# Altium project LCD_Module.PrjPcb
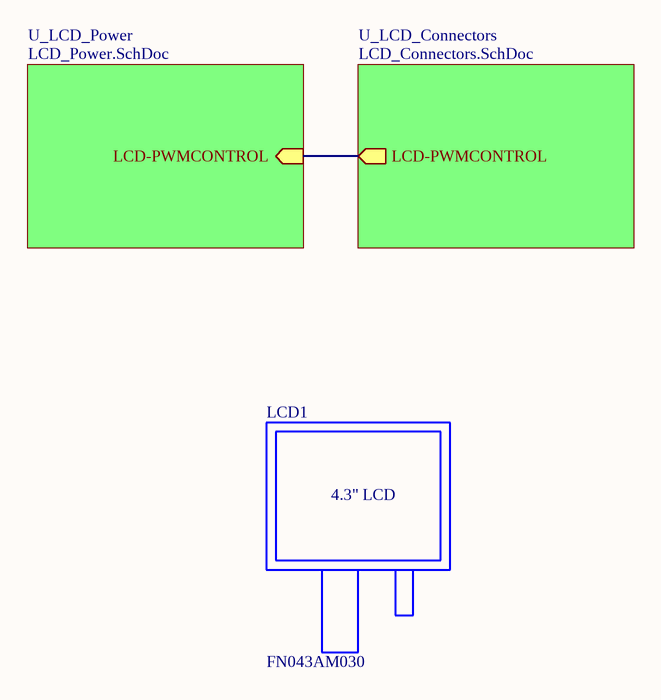
[diagram p0: Main.SchDoc]
3 sheets, 14 parts. Net scope: hierarchical (ports join the sheet entries above them; power ports are global).
Board file: LDC_Module.PcbDoc
Sheets:
  Main.SchDoc
    U_LCD_Power = LCD_Power.SchDoc
    U_LCD_Connectors = LCD_Connectors.SchDoc

## Sheet Main.SchDoc
size A4; SheetNumber: 1; SheetTotal: 3

### Parts
LCD1  FN043AM030  [LCD_4.3"]

### Sub-sheets
U_LCD_Connectors = LCD_Connectors.SchDoc: LCD-PWMCONTROL (out)
U_LCD_Power = LCD_Power.SchDoc: LCD-PWMCONTROL (in)

### Nets
LCD-PWMCONTROL: sheet U_LCD_Power/LCD-PWMCONTROL, sheet U_LCD_Connectors/LCD-PWMCONTROL

### Notes on the sheet
- (in symbol FN043AM030) 4.3" LCD

### Library data of the parts
LCD1 = FN043AM030: TFT 4.3” 480X272 WITH CTP FT5426; Manufacturer: FANNAL; MFC PN: FN043AM030; Value: FN043AM030; Assembly: *; Help URL: https://www.ozdisan.com/p/tft-paneller-381/fannal-fn043am030-v1-0-535823

## Sheet LCD_Power.SchDoc
size A4; SheetNumber: 2; SheetTotal: 3
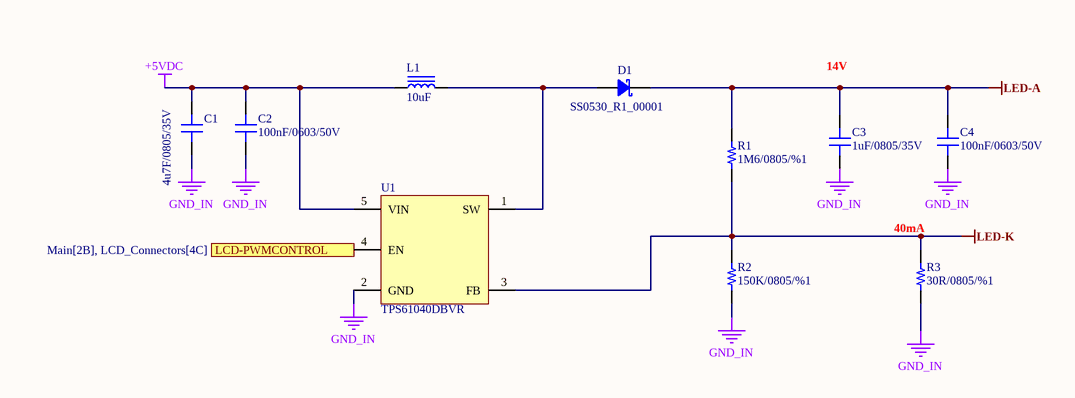
[diagram p1: LCD_Power.SchDoc]

### Parts
C1  4u7F/0805/35V  [0805_cap]
C2  100nF/0603/50V  [0603_cap]
C3  1uF/0805/35V  [0603_cap]
C4  100nF/0603/50V  [0603_cap]
D1  SS0530_R1_00001  [SOD-123]
L1  10uF  [IND(4.5mmX4mm)]
R1  1M6/0805/%1  [0805_res]
R2  150K/0805/%1  [0805_res]
R3  30R/0805/%1  [0805_res]
U1  TPS61040DBVR  [SOT-23-5]

### Ports
LCD-PWMCONTROL (in, see Main[2B], LCD_Connectors[4C])

### Nets
+5VDC: C1.2 C2.2 L1.1 U1.5(VIN)
GND_IN: C1.1 C2.1 C3.1 C4.1 R2.1 R3.1 U1.2(GND)
LED-A: C3.2 C4.2 D1.1 R1.2
LED-K: R1.1 R2.2 R3.2 U1.3(FB)
LCD-PWMCONTROL: U1.4(EN) ; port LCD-PWMCONTROL
NetD1_2: D1.2 L1.2 U1.1(SW)

### Notes on the sheet
- 14V
- (near R3) 40mA

### Library data of the parts
C1-C4 = Capacitor: HelpURL: *; PN: *; Assembly: *
  C1: Value: 4u7F/0805/35V
  C2 C4: Value: 100nF/0603/50V
  C3: Value: 1uF/0805/35V
D1 = SCHOTKY DIODE
L1 = Inductor: CR32NP-100KC
R1-R3 = RES: Assembly: .; HelpURL: *; PN: *
  R1: Value: 1M6/0805/%1
  R2: Value: 150K/0805/%1
  R3: Value: 30R/0805/%1
U1 = TPS61040DBVR: LED Driver IC 1 Output DC DC Regulator Step-Up (Boost) PWM Dimming 350mA (Switch) SOT-23-5; Manufacturer: Texas Instruments; Assembly: .; HelpURL: https://www.digikey.com/en/products/detail/texas-instruments/TPS61040DBVR/454263; Value: TPS61040DBVR

## Sheet LCD_Connectors.SchDoc
size A4; SheetNumber: 3; SheetTotal: 3
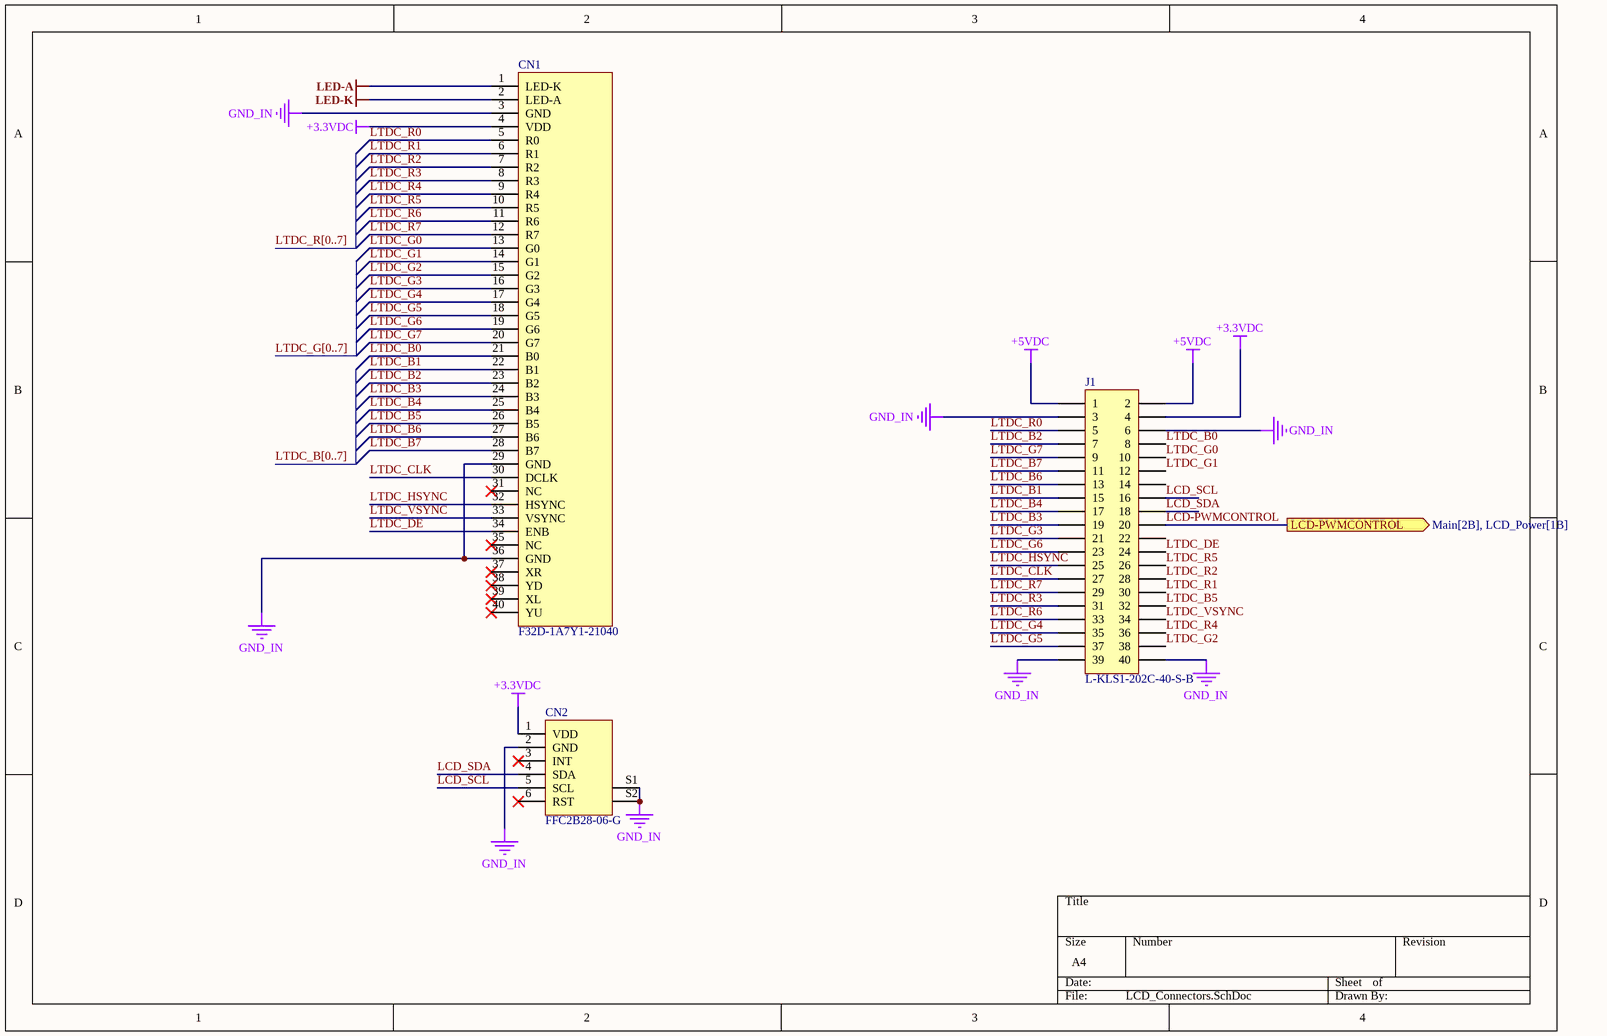
[diagram p2: LCD_Connectors.SchDoc]

### Parts
CN1  F32D-1A7Y1-21040  [FPC_40POS_DOUBLESIDE]
CN2  FFC2B28-06-G  [FPC_6POS_DOUBLESIDE]
J1  L-KLS1-202C-40-S-B  [L-KLS1-202C-40-T-B]

### Ports
LCD-PWMCONTROL (out, see Main[2B], LCD_Power[1B])

### Nets
+3.3VDC: CN1.4(VDD) CN2.1(VDD) J1.4
+5VDC: J1.1 J1.2
GND_IN: CN1.3(GND) CN1.29(GND) CN1.36(GND) CN2.2(GND) CN2.S1(SHIELD) CN2.S2(SHIELD) J1.3 J1.6 J1.39 J1.40
LED-A: CN1.1(LED-K)
LED-K: CN1.2(LED-A)
LCD-PWMCONTROL: J1.20 ; port LCD-PWMCONTROL
LCD_SCL: CN2.5(SCL) J1.16
LCD_SDA: CN2.4(SDA) J1.18
LTDC_B0: CN1.21(B0) J1.8
LTDC_B1: CN1.22(B1) J1.15
LTDC_B2: CN1.23(B2) J1.7
LTDC_B3: CN1.24(B3) J1.19
LTDC_B4: CN1.25(B4) J1.17
LTDC_B5: CN1.26(B5) J1.32
LTDC_B6: CN1.27(B6) J1.13
LTDC_B7: CN1.28(B7) J1.11
LTDC_CLK: CN1.30(DCLK) J1.27
LTDC_DE: CN1.34(ENB) J1.24
LTDC_G0: CN1.13(G0) J1.10
LTDC_G1: CN1.14(G1) J1.12
LTDC_G2: CN1.15(G2) J1.38
LTDC_G3: CN1.16(G3) J1.21
LTDC_G4: CN1.17(G4) J1.35
LTDC_G5: CN1.18(G5) J1.37
LTDC_G6: CN1.19(G6) J1.23
LTDC_G7: CN1.20(G7) J1.9
LTDC_HSYNC: CN1.32(HSYNC) J1.25
LTDC_R0: CN1.5(R0) J1.5
LTDC_R1: CN1.6(R1) J1.30
LTDC_R2: CN1.7(R2) J1.28
LTDC_R3: CN1.8(R3) J1.31
LTDC_R4: CN1.9(R4) J1.36
LTDC_R5: CN1.10(R5) J1.26
LTDC_R6: CN1.11(R6) J1.33
LTDC_R7: CN1.12(R7) J1.29
LTDC_VSYNC: CN1.33(VSYNC) J1.34

Not connected (* = marked no-connect by the designer): CN1 31(NC)* 35(NC)* 37(XR)* 38(YD)* 39(XL)* 40(YU)*; CN2 3(INT)* 6(RST)*; J1 14 22

### Buses and harness runs
bus LTDC_B[0..7]
bus LTDC_G[0..7]
bus LTDC_R[0..7]

### Library data of the parts
CN1 = FPC CONN 40POS: CONN FFC BOTTOM 40POS 0.5MM R/A; Assembly: .; PN: F32D-1A7Y1-21040; Value: F32D-1A7Y1-21040; HelpURL: https://www.digikey.com/en/products/detail/amphenol-cs-fci/F32D-1A7Y1-21040/11564657?s=N4IgTCBcDaIGIGYwBEC0BGAggdgJrtTHQAYAWYkAXQF8g
CN2 = FPC CONN 6POS: Assembly: .; Value: FFC2B28-06-G; PN: FFC2B28-06-G; HelpURL: https://www.digikey.com/en/products/detail/gct/FFC2B28-06-G/12819956?s=N4IgTCBcDaIGJwMJgEJgBwFoAMA2TA4iALoC%2BQA
J1 = 2X20: BOX HEADER 40PIN(2x20) 1.27MM THT V/T MALE BLACK; Assembly: .; Value: L-KLS1-202C-40-S-B; PN: L-KLS1-202C-40-S-B; HelpURL: https://www.ozdisan.com/p/box-headerlar-295/kls-electronic-l-kls1-202c-40-s-b-531010

## Nets that join several sheets
+5VDC: LCD_Power (C1.2 C2.2 L1.1 U1.5), LCD_Connectors (J1.1 J1.2)
GND_IN: LCD_Power (7 pins), LCD_Connectors (10 pins)
LED-A: LCD_Power (C3.2 C4.2 D1.1 R1.2), LCD_Connectors (CN1.1)
LED-K: LCD_Power (R1.1 R2.2 R3.2 U1.3), LCD_Connectors (CN1.2)
LCD-PWMCONTROL: LCD_Power (U1.4), LCD_Connectors (J1.20)